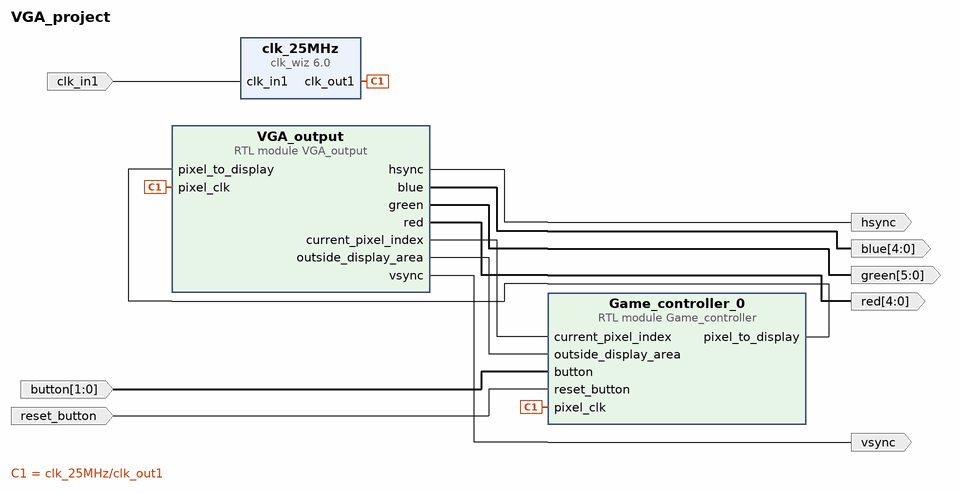
[diagram p0: block diagram of the top level]
# Vivado block design VGA_project, xc7z010clg400-1, Vivado 2018.2
create_bd_design VGA_project

create_bd_port -dir I -type clk clk_in1
set_property -dict {CONFIG.FREQ_HZ 125000000} [get_bd_ports clk_in1]
create_bd_port -dir O hsync
create_bd_port -dir O vsync
create_bd_port -dir O -from 4 -to 0 red
create_bd_port -dir O -from 5 -to 0 green
create_bd_port -dir O -from 4 -to 0 blue
create_bd_port -dir I -from 1 -to 0 button
create_bd_port -dir I -type rst reset_button

create_bd_cell -type ip -vlnv xilinx.com:ip:clk_wiz:6.0 clk_25MHz
set_property -dict [list \
  CONFIG.PRIMITIVE PLL \
  CONFIG.USE_FREQ_SYNTH true \
  CONFIG.PRIM_IN_FREQ 125.000 \
  CONFIG.CLKIN1_JITTER_PS 80.0 \
  CONFIG.CLKOUT1_REQUESTED_OUT_FREQ 25.000 \
  CONFIG.PRIM_SOURCE No_buffer \
  CONFIG.CLKOUT1_DRIVES BUFG \
  CONFIG.CLKOUT2_DRIVES BUFG \
  CONFIG.CLKOUT3_DRIVES BUFG \
  CONFIG.CLKOUT4_DRIVES BUFG \
  CONFIG.CLKOUT5_DRIVES BUFG \
  CONFIG.CLKOUT6_DRIVES BUFG \
  CONFIG.CLKOUT7_DRIVES BUFG \
  CONFIG.USE_LOCKED false \
  CONFIG.USE_RESET false \
  CONFIG.MMCM_DIVCLK_DIVIDE 5 \
  CONFIG.MMCM_CLKFBOUT_MULT_F 33 \
  CONFIG.MMCM_CLKIN1_PERIOD 8.000 \
  CONFIG.MMCM_CLKIN2_PERIOD 10.0 \
  CONFIG.MMCM_COMPENSATION ZHOLD \
  CONFIG.MMCM_CLKOUT0_DIVIDE_F 33 \
  CONFIG.CLKOUT1_JITTER 345.102 \
  CONFIG.CLKOUT1_PHASE_ERROR 261.747 \
] [get_bd_cells clk_25MHz]
create_bd_cell -type module -reference VGA_output VGA_output
create_bd_cell -type module -reference Game_controller Game_controller_0

# ---- connections ----

connect_bd_net -net clk_in1_1 [get_bd_ports clk_in1] [get_bd_pins clk_25MHz/clk_in1]
connect_bd_net -net clk_wiz_0_clk_out1 [get_bd_pins clk_25MHz/clk_out1] [get_bd_pins VGA_output/pixel_clk] [get_bd_pins Game_controller_0/pixel_clk]
connect_bd_net -net VGA_output_0_hsync [get_bd_pins VGA_output/hsync] [get_bd_ports hsync]
connect_bd_net -net VGA_output_0_vsync [get_bd_pins VGA_output/vsync] [get_bd_ports vsync]
connect_bd_net -net VGA_output_0_red [get_bd_pins VGA_output/red] [get_bd_ports red]
connect_bd_net -net VGA_output_0_green [get_bd_pins VGA_output/green] [get_bd_ports green]
connect_bd_net -net VGA_output_0_blue [get_bd_pins VGA_output/blue] [get_bd_ports blue]
connect_bd_net [get_bd_pins VGA_output/current_pixel_index] [get_bd_pins Game_controller_0/current_pixel_index]
connect_bd_net [get_bd_pins Game_controller_0/pixel_to_display] [get_bd_pins VGA_output/pixel_to_display]
connect_bd_net [get_bd_pins VGA_output/outside_display_area] [get_bd_pins Game_controller_0/outside_display_area]
connect_bd_net [get_bd_ports button] [get_bd_pins Game_controller_0/button]
connect_bd_net [get_bd_ports reset_button] [get_bd_pins Game_controller_0/reset_button]

validate_bd_design
save_bd_design
